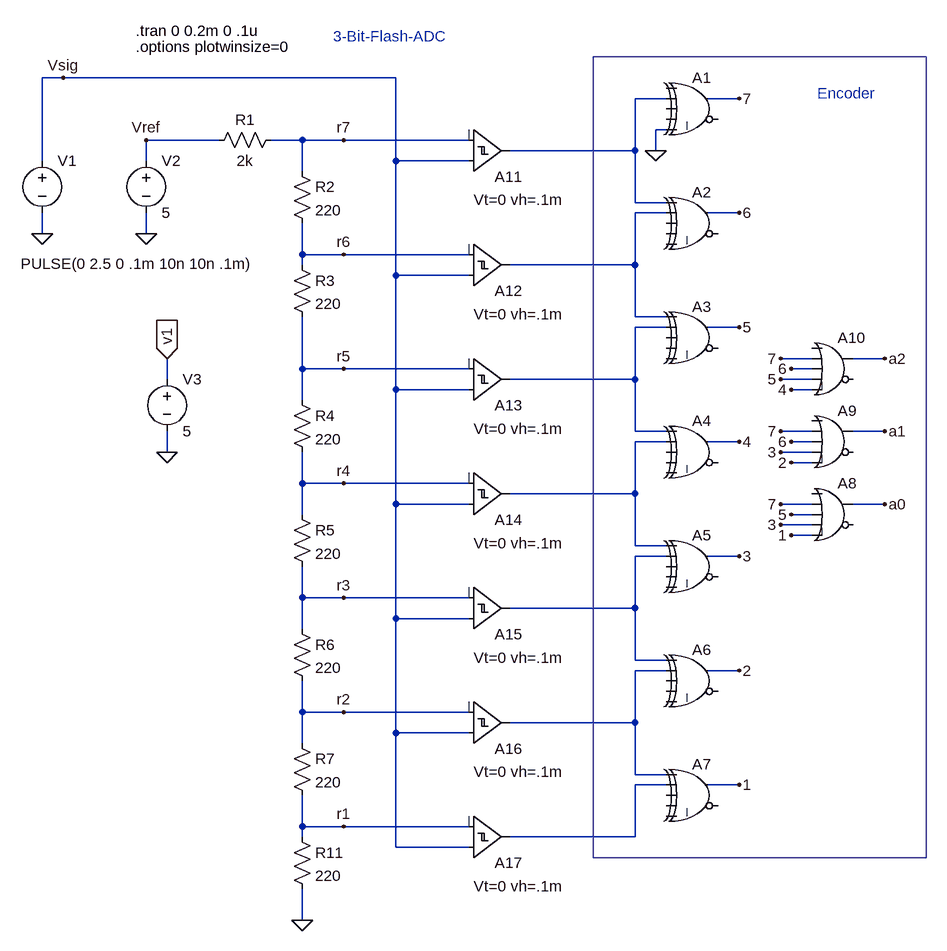
[diagram p0: schematic 3-bit-flash-adc2.asc]
3-bit-flash-adc2.asc, the LTspice schematic file:
Version 4
SHEET 1 2380 1240
WIRE -464 -400 -496 -400
WIRE 48 -400 -464 -400
WIRE 464 -368 416 -368
WIRE 576 -368 528 -368
WIRE 464 -320 448 -320
WIRE -224 -304 -336 -304
WIRE -96 -304 -144 -304
WIRE -32 -304 -96 -304
WIRE 160 -304 -32 -304
WIRE 416 -288 416 -368
WIRE 416 -288 224 -288
WIRE 448 -288 448 -320
WIRE -496 -272 -496 -400
WIRE -336 -272 -336 -304
WIRE 48 -272 48 -400
WIRE 160 -272 48 -272
WIRE -96 -256 -96 -304
WIRE 416 -208 416 -288
WIRE 464 -208 416 -208
WIRE 464 -192 416 -192
WIRE 576 -192 528 -192
WIRE -496 -160 -496 -192
WIRE -336 -160 -336 -192
WIRE -96 -128 -96 -176
WIRE -32 -128 -96 -128
WIRE 160 -128 -32 -128
WIRE -96 -112 -96 -128
WIRE 416 -112 416 -192
WIRE 416 -112 224 -112
WIRE 48 -96 48 -272
WIRE 160 -96 48 -96
WIRE 416 -32 416 -112
WIRE 464 -32 416 -32
WIRE 464 -16 416 -16
WIRE 576 -16 528 -16
WIRE 688 32 640 32
WIRE 800 32 752 32
WIRE -96 48 -96 -32
WIRE -32 48 -96 48
WIRE 160 48 -32 48
WIRE 688 48 656 48
WIRE -304 64 -304 32
WIRE 416 64 416 -16
WIRE 416 64 224 64
WIRE 688 64 640 64
WIRE 48 80 48 -96
WIRE 160 80 48 80
WIRE 688 80 656 80
WIRE -96 96 -96 48
WIRE 416 144 416 64
WIRE 464 144 416 144
WIRE 688 144 640 144
WIRE 800 144 752 144
WIRE 464 160 416 160
WIRE 576 160 528 160
WIRE 688 160 656 160
WIRE -304 176 -304 144
WIRE 688 176 640 176
WIRE 688 192 656 192
WIRE -96 224 -96 176
WIRE -32 224 -96 224
WIRE 160 224 -32 224
WIRE 416 240 416 160
WIRE 416 240 224 240
WIRE 48 256 48 80
WIRE 160 256 48 256
WIRE 688 256 640 256
WIRE 800 256 752 256
WIRE -96 272 -96 224
WIRE 688 272 656 272
WIRE 688 288 640 288
WIRE 688 304 656 304
WIRE 416 320 416 240
WIRE 464 320 416 320
WIRE 464 336 416 336
WIRE 576 336 528 336
WIRE -96 400 -96 352
WIRE -32 400 -96 400
WIRE 160 400 -32 400
WIRE 416 416 416 336
WIRE 416 416 224 416
WIRE 48 432 48 256
WIRE 160 432 48 432
WIRE -96 448 -96 400
WIRE 416 496 416 416
WIRE 464 496 416 496
WIRE 464 512 416 512
WIRE 576 512 528 512
WIRE -96 576 -96 528
WIRE -32 576 -96 576
WIRE 160 576 -32 576
WIRE 416 592 416 512
WIRE 416 592 224 592
WIRE 48 608 48 432
WIRE 160 608 48 608
WIRE -96 624 -96 576
WIRE 416 672 416 592
WIRE 464 672 416 672
WIRE 464 688 416 688
WIRE 576 688 528 688
WIRE -96 752 -96 704
WIRE -32 752 -96 752
WIRE 160 752 -32 752
WIRE -96 768 -96 752
WIRE 416 768 416 688
WIRE 416 768 224 768
WIRE 48 784 48 608
WIRE 160 784 48 784
WIRE -96 896 -96 848
FLAG -96 896 0
FLAG -496 -160 0
FLAG -336 -160 0
FLAG -304 32 v1
IOPIN -304 32 In
FLAG -304 176 0
FLAG 448 -288 0
FLAG -464 -400 Vsig
FLAG -336 -304 Vref
FLAG 576 688 1
FLAG 576 512 2
FLAG 576 336 3
FLAG 576 160 4
FLAG 576 -16 5
FLAG 576 -192 6
FLAG 576 -368 7
FLAG 640 288 3
FLAG 656 272 5
FLAG 640 256 7
FLAG 656 304 1
FLAG 640 176 3
FLAG 656 160 6
FLAG 640 144 7
FLAG 656 192 2
FLAG 640 64 5
FLAG 656 48 6
FLAG 640 32 7
FLAG 656 80 4
FLAG 800 256 a0
FLAG 800 144 a1
FLAG 800 32 a2
FLAG -32 -304 r7
FLAG -32 -128 r6
FLAG -32 48 r5
FLAG -32 224 r4
FLAG -32 400 r3
FLAG -32 576 r2
FLAG -32 752 r1
SYMBOL res -240 -288 R270
WINDOW 0 32 56 VTop 0
WINDOW 3 0 56 VBottom 0
SYMATTR InstName R1
SYMATTR Value 2k
SYMBOL res -112 -272 R0
SYMATTR InstName R2
SYMATTR Value 220
SYMBOL res -112 -128 R0
SYMATTR InstName R3
SYMATTR Value 220
SYMBOL res -112 80 R0
SYMATTR InstName R4
SYMATTR Value 220
SYMBOL res -112 256 R0
SYMATTR InstName R5
SYMATTR Value 220
SYMBOL res -112 432 R0
SYMATTR InstName R6
SYMATTR Value 220
SYMBOL res -112 608 R0
SYMATTR InstName R7
SYMATTR Value 220
SYMBOL Digital\\xor 512 -416 R0
SYMATTR InstName A1
SYMBOL Digital\\xor 512 -240 R0
SYMATTR InstName A2
SYMBOL Digital\\xor 512 -64 R0
SYMATTR InstName A3
SYMBOL Digital\\xor 512 112 R0
SYMATTR InstName A4
SYMBOL Digital\\xor 512 288 R0
SYMATTR InstName A5
SYMBOL Digital\\xor 512 464 R0
SYMATTR InstName A6
SYMBOL Digital\\xor 512 640 R0
SYMATTR InstName A7
SYMBOL voltage -496 -288 R0
WINDOW 123 37 74 Left 0
WINDOW 39 0 0 Left 0
WINDOW 3 -33 174 Left 0
SYMATTR Value PULSE(0 2.5 0 .1m 10n 10n .1m)
SYMATTR InstName V1
SYMBOL res -112 752 R0
SYMATTR InstName R11
SYMATTR Value 220
SYMBOL voltage -336 -288 R0
WINDOW 123 0 0 Left 0
WINDOW 39 0 0 Left 0
SYMATTR InstName V2
SYMATTR Value 5
SYMBOL voltage -304 48 R0
WINDOW 123 0 0 Left 0
WINDOW 39 24 132 Left 0
SYMATTR InstName V3
SYMATTR Value 5
SYMBOL Digital\\or 720 208 R0
SYMATTR InstName A8
SYMBOL Digital\\or 720 96 R0
SYMATTR InstName A9
SYMBOL Digital\\or 720 -16 R0
SYMATTR InstName A10
SYMBOL Digital\\diffschmtbuf 160 -224 M180
WINDOW 3 8 -12 Left 0
SYMATTR InstName A11
SYMATTR Value Vt=0 vh=.1m
SYMATTR Value2 tripdt=1n
SYMBOL Digital\\diffschmtbuf 160 -48 M180
WINDOW 3 8 -12 Left 0
SYMATTR InstName A12
SYMATTR Value Vt=0 vh=.1m
SYMATTR Value2 tripdt=1n
SYMBOL Digital\\diffschmtbuf 160 128 M180
WINDOW 3 8 -12 Left 0
SYMATTR InstName A13
SYMATTR Value Vt=0 vh=.1m
SYMATTR Value2 tripdt=1n
SYMBOL Digital\\diffschmtbuf 160 304 M180
WINDOW 3 8 -12 Left 0
SYMATTR InstName A14
SYMATTR Value Vt=0 vh=.1m
SYMATTR Value2 tripdt=1n
SYMBOL Digital\\diffschmtbuf 160 480 M180
WINDOW 3 8 -12 Left 0
SYMATTR InstName A15
SYMATTR Value Vt=0 vh=.1m
SYMATTR Value2 tripdt=1n
SYMBOL Digital\\diffschmtbuf 160 656 M180
WINDOW 3 8 -12 Left 0
SYMATTR InstName A16
SYMATTR Value Vt=0 vh=.1m
SYMATTR Value2 tripdt=1n
SYMBOL Digital\\diffschmtbuf 160 832 M180
WINDOW 3 8 -12 Left 0
SYMATTR InstName A17
SYMATTR Value Vt=0 vh=.1m
SYMATTR Value2 tripdt=1n
TEXT -352 -472 Left 0 !.tran 0 0.2m 0 .1u
TEXT -352 -448 Left 0 !.options plotwinsize=0
TEXT -48 -464 Left 0 ;3-Bit-Flash-ADC
TEXT 696 -376 Left 0 ;Encoder
RECTANGLE Normal 864 800 352 -432

The netlist it stands for:
* 3-bit-flash-adc2.asc
R1 Vref r7 2k
R2 r7 r6 220
R3 r6 r5 220
R4 r5 r4 220
R5 r4 r3 220
R6 r3 r2 220
R7 r2 r1 220
A1 0 N001 0 0 0 0 7 0 XOR
A2 N001 N002 0 0 0 0 6 0 XOR
A3 N002 N003 0 0 0 0 5 0 XOR
A4 N003 N004 0 0 0 0 4 0 XOR
A5 N004 N005 0 0 0 0 3 0 XOR
A6 N005 N006 0 0 0 0 2 0 XOR
A7 N006 N007 0 0 0 0 1 0 XOR
V1 Vsig 0 PULSE(0 2.5 0 .1m 10n 10n .1m)
R11 r1 0 220
V2 Vref 0 5
V3 v1 0 5
A8 0 7 5 3 1 0 a0 0 OR
A9 0 7 6 3 2 0 a1 0 OR
A10 0 7 6 5 4 0 a2 0 OR
A11 Vsig r7 0 0 0 0 N001 0 SCHMITT Vt=0 vh=.1m tripdt=1n
A12 Vsig r6 0 0 0 0 N002 0 SCHMITT Vt=0 vh=.1m tripdt=1n
A13 Vsig r5 0 0 0 0 N003 0 SCHMITT Vt=0 vh=.1m tripdt=1n
A14 Vsig r4 0 0 0 0 N004 0 SCHMITT Vt=0 vh=.1m tripdt=1n
A15 Vsig r3 0 0 0 0 N005 0 SCHMITT Vt=0 vh=.1m tripdt=1n
A16 Vsig r2 0 0 0 0 N006 0 SCHMITT Vt=0 vh=.1m tripdt=1n
A17 Vsig r1 0 0 0 0 N007 0 SCHMITT Vt=0 vh=.1m tripdt=1n
.tran 0 0.2m 0 .1u
.options plotwinsize=0
* 3-Bit-Flash-ADC
* Encoder
.backanno
.end